# Altium schematic sheet callisto_schematics_digital.SchDoc: Callisto Module Digital
size A3; ApprovedBy: Tomash Ghz; CheckedBy: Tomash Ghz; Author: Tomash Ghz; CompanyName: GHz Labs; DrawnBy: Tomash Ghz; Engineer: Tomash Ghz; Organization: GHz Labs; Address1: Tomash Ghz; Address2: Berlin 2019; Revision: 1.0; SheetNumber: 1; SheetTotal: 2; DocumentName: Callisto Module Digital; ProjectName: Callisto Module
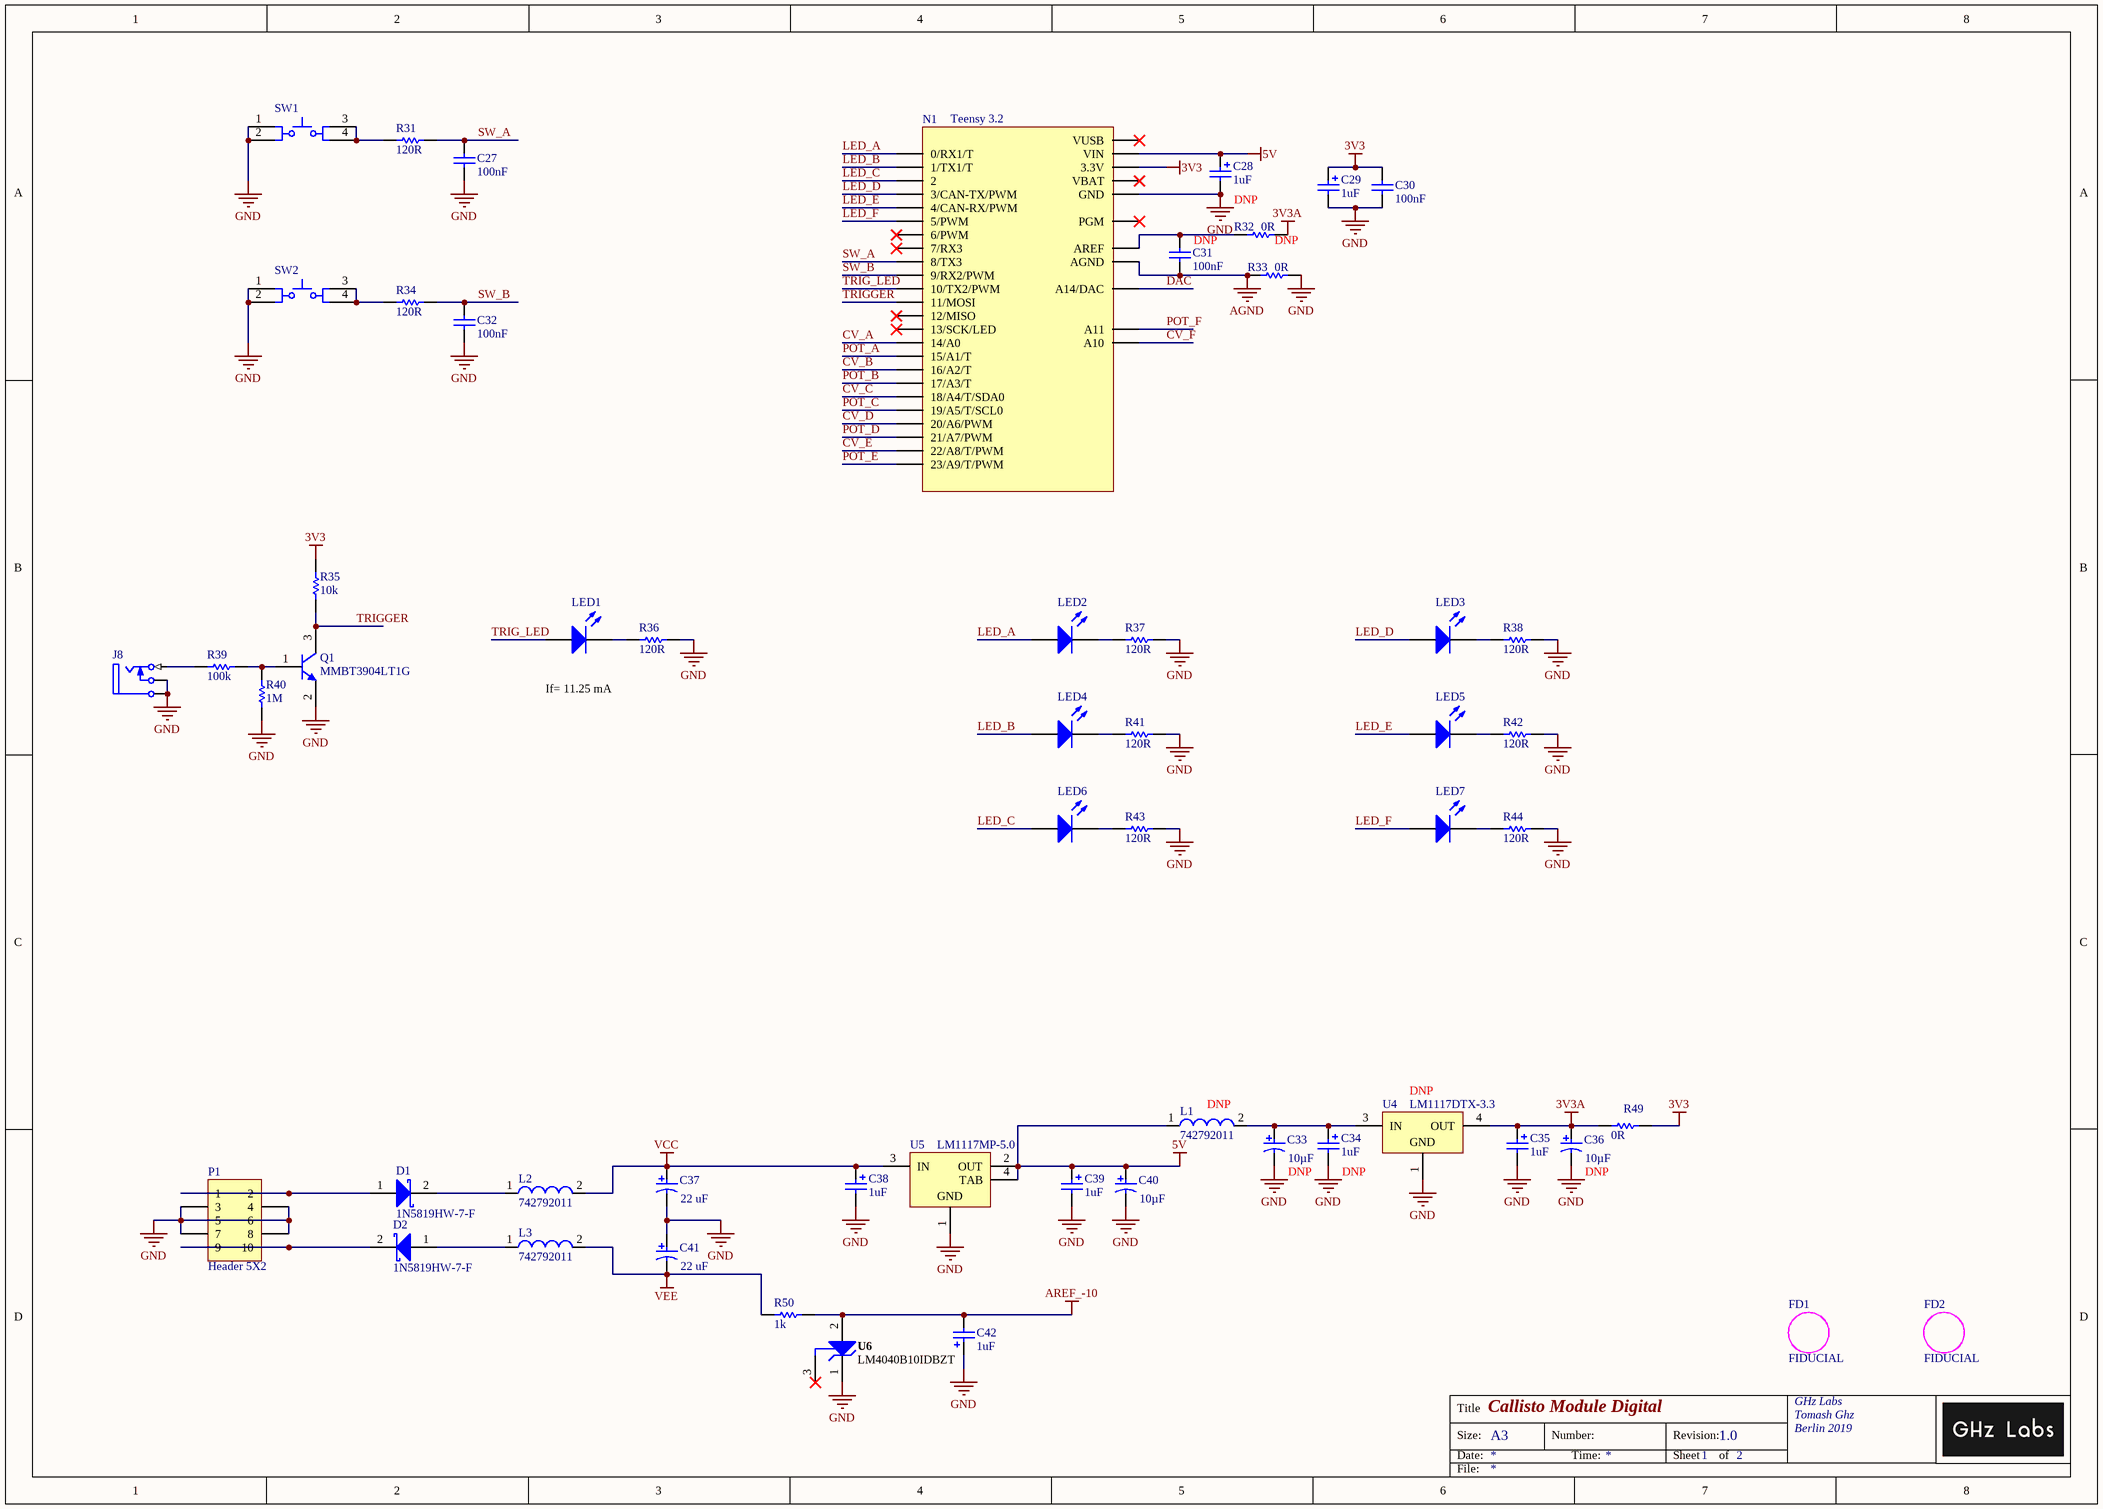
[diagram p0: callisto_schematics_digital.SchDoc]

## Parts
C27  100nF  [CAPA_0805]
C28  1uF  [CAPA_0805 Pol]
C29  1uF  [CAPA_0805 Pol]
C30  100nF  [CAPA_0805]
C31  100nF  [CAPA_0805]
C32  100nF  [CAPA_0805]
C33  Capacitance: 10µF  [PNSC-FK-V-B_V]  (hidden comment: EEE-FK1V100UR)
C34  1uF  [CAPA_0805 Pol]
C35  1uF  [CAPA_0805 Pol]
C36  Capacitance: 10µF  [PNSC-FK-V-B_V]  (hidden comment: EEE-FK1V100UR)
C37  Rated Capacitance: 22 uF  [NIC-CAPA2-5X5.8_V]  (hidden comment: 22uF Electrolytic Capacitor)
C38  1uF  [CAPA_0805 Pol]
C39  1uF  [CAPA_0805 Pol]
C40  Capacitance: 10µF  [PNSC-FK-V-B_V]  (hidden comment: 10uF Electrolytic Capacitor)
C41  Rated Capacitance: 22 uF  [NIC-CAPA2-5X5.8_V]  (hidden comment: 22uF Electrolytic Capacitor)
C42  1uF  [CAPA_0805 Pol]
D1  1N5819HW-7-F  [DIOD-SOD-123-2_V]
D2  1N5819HW-7-F  [DIOD-SOD-123-2_V]
FD1  FIDUCIAL  [FIDUCIAL]  (no BOM)
FD2  FIDUCIAL  [FIDUCIAL]  (no BOM)
J8  Phonejack2 TN  [Thonkiconn]  (value not drawn)
L1  742792011  [SMD-0805]
L2  742792011  [SMD-0805]
L3  742792011  [SMD-0805]
LED1  WP424YDT  [Type 3mm]  (value not drawn)
LED2  WP424YDT  [Type 3mm]  (value not drawn)
LED3  WP424YDT  [Type 3mm]  (value not drawn)
LED4  WP424YDT  [Type 3mm]  (value not drawn)
LED5  WP424YDT  [Type 3mm]  (value not drawn)
LED6  WP424YDT  [Type 3mm]  (value not drawn)
LED7  WP424YDT  [Type 3mm]  (value not drawn)
N1  Teensy 3.2  [TEENSY_3.0-3.2&LC_ALL_PINS]
P1  Header 5X2  [HDR2X5]
Q1  MMBT3904LT1G  [ONSC-SOT-23-3-318-08_V]
R31  120R  [RES_0805]
R32  0R  [RES_0805]
R33  0R  [RES_0805]
R34  120R  [RES_0805]
R35  10k  [RES_0805]
R36  120R  [RES_0805]
R37  120R  [RES_0805]
R38  120R  [RES_0805]
R39  100k  [RES_0805]
R40  1M  [RES_0805]
R41  120R  [RES_0805]
R42  120R  [RES_0805]
R43  120R  [RES_0805]
R44  120R  [RES_0805]
R49  0R  [RES_0805]
R50  1k  [RES_0805]
SW1  Tact Switch  [ESWI-TL1105SPF_V]  (value not drawn)
SW2  Tact Switch  [ESWI-TL1105SPF_V]  (value not drawn)
U4  LM1117DTX-3.3  [TD03B_M]
U5  LM1117MP-5.0  [MP04A_M]
U6  LM4040B10IDBZT  [DBZ0003A_M]

## Nets
3V3: C29.1 C30.1 N1.3.3V_3.3V1(3.3V) R35.1 R49.2
3V3A: C35.1 C36.1 R32.2 R49.1 U4.4(OUT)
5V: C28.1 C39.1 C40.1 L1.1 N1.VIN U5.2(OUT) U5.4(TAB)
AGND: C31.2 N1.AGND R33.1
AREF_-10: C42.2 R50.1 U6.2(ANODE)
GND: C27.2 C28.2 C29.2 C30.2 C32.2 C33.2 C34.2 C35.2 C36.2 C37.2 C38.2 C39.2 C40.2 C41.1 C42.1 J8.2(TN) J8.5(S) N1.GND_GND1(GND) P1.3 P1.4 P1.5 P1.6 P1.7 P1.8 Q1.2(E) R33.2 R36.1 R37.1 R38.1 R40.2 R41.1 R42.1 R43.1 R44.1 SW1.1 SW1.2 SW2.1 SW2.2 U4.1(GND) U5.1(GND) U6.1(CATHODE)
VCC: C37.1 C38.1 L2.2 U5.3(IN)
VEE: C41.2 L3.2 R50.2
CV_A: N1.14/A0
CV_B: N1.16/A2(16/A2/T)
CV_C: N1.18/A4(18/A4/T/SDA0)
CV_D: N1.20/A6(20/A6/PWM)
CV_E: N1.22/A8(22/A8/T/PWM)
CV_F: N1.A10
DAC: N1.RESET/DAC(A14/DAC)
LED_A: LED2.2(A) N1.0(0/RX1/T)
LED_B: LED4.2(A) N1.1(1/TX1/T)
LED_C: LED6.2(A) N1.2
LED_D: LED3.2(A) N1.3(3/CAN-TX/PWM)
LED_E: LED5.2(A) N1.4(4/CAN-RX/PWM)
LED_F: LED7.2(A) N1.5(5/PWM)
POT_A: N1.15/A1(15/A1/T)
POT_B: N1.17/A3(17/A3/T)
POT_C: N1.19/A5(19/A5/T/SCL0)
POT_D: N1.21/A7(21/A7/PWM)
POT_E: N1.23/A9(23/A9/T/PWM)
POT_F: N1.A11
SW_A: C27.1 N1.8(8/TX3) R31.1
SW_B: C32.1 N1.9(9/RX2/PWM) R34.1
TRIG_LED: LED1.2(A) N1.10(10/TX2/PWM)
TRIGGER: N1.11(11/MOSI) Q1.3(C) R35.2
NetC31_1: C31.1 N1.AREF R32.1
NetC33_1: C33.1 C34.1 L1.2 U4.3(IN)
NetD1_1: D1.1(A) P1.1 P1.2
NetD1_2: D1.2(K) L2.1
NetD2_1: D2.1(A) L3.1
NetD2_2: D2.2(K) P1.9 P1.10
NetJ8_1: J8.1(T) R39.2
NetLED1_1: LED1.1(K) R36.2
NetLED2_1: LED2.1(K) R37.2
NetLED3_1: LED3.1(K) R38.2
NetLED4_1: LED4.1(K) R41.2
NetLED5_1: LED5.1(K) R42.2
NetLED6_1: LED6.1(K) R43.2
NetLED7_1: LED7.1(K) R44.2
NetQ1_1: Q1.1(B) R39.1 R40.1
NetR31_2: R31.2 SW1.3 SW1.4
NetR34_2: R34.2 SW2.3 SW2.4

Not connected (* = marked no-connect by the designer): N1 6(6/PWM)* 7(7/RX3)* 12(12/MISO)* 13(13/SCK/LED)* PGM* VBAT* VUSB*; U6 3(NC)*

## Notes on the sheet
- (near C31) DNP
- DNP
- (near R32) DNP
- If= 11.25 mA
- (near L1) DNP
- (near U4) DNP
- (near C36) DNP
- Title
- Size:
- Date:
- A3
- Number:
- Time:
- Revision:
- Sheet
- of
- File:

## Library data of the parts
C27 C30-C32 = Cap: Capacitor; PartNumber: C0805C104K4RAC; Manufacturer: KEMET; Published: 8-Jun-2000; LatestRevisionDate: 17-Jul-2002; LatestRevisionNote: Re-released for DXP Platform.; PackageReference: RAD-0.3; Publisher: Altium Limited; PackageDescription: Radial Cap, Thru-Hole; 2 Leads; 0.3 in Pin Spacing; Value: 100nF
C28 C29 C34 C35 C38 C39 C42 = Cap Pol2: Polarized Capacitor; PartNumber: GRM21BR61C105KA01L; Manufacturer: Murata Electronics; Value: 1uF; Mouser: http://www.mouser.de/ProductDetail/Murata-Electronics/GRM21BR61C105KA01L/?qs=sGAEpiMZZMs0AnBnWHyRQHqtMhGnfkOVy3Os4ZS1iuU%3d
C33 C36 = CMP-2000-06211-1: Aluminum Electrolytic Capacitor, 10 uF, +/- 20%, 35 V, 2-Pin SMD (Size Code B), -55 to 105 degC, RoHS, Tape and Reel; Manufacturer: Panasonic; Impedance: 1.35O; Rated Voltage: 35V; Lifetime@Temperature: 2000Hrs@105°C; Ripple Current: 90mA; Type: Can; Manufacturer URL: http://www.panasonic.com/; Package Reference: FK-V-B; Operating Temp Range: -55to+105°C; Series: FK; Datasheet URL: http://industrial.panasonic.com/cdbs/www-data/pdf/RDE0000/ABA0000C1181.pdf; Mounting Technology: SurfaceMount; Package URL: http://industrial.panasonic.com/cdbs/www-data/pdf/RDE0000/DME0000COL48.pdf; Package Description: 2-Pin Electrolytic Aluminum Capacitor, Body 4.3 x 4.3 mm; Datasheet Version: 03/2016; Case Size/Dimension: Ø4x5.8mm; Operating Temp-Max: 105°C
C37 C41 = CMP-0687-00027-1: Aluminum Electrolytic Capacitor, UD Series, Low Impedance, 22 uF, 16 V, + / - 20%, -55 to 105 degC, Chip Type, 5 x 5.8 mm D x L, Pb-Free, Reel; PartNumber: EEE-FK1V220R; Manufacturer: Panasonic; Tolerance Rated Capacitance: -20 to 20%; Endurance Time: 2000 h; Impedance: 0.76 Ohm; Rated Voltage: 16 V; Rated Ripple Current (at 100kHz): 150 mA; Packing: Dia382mm Reel; RoHS: TRUE; ComponentLink1URL: http://www.nichicon.co.jp/; PackageReference: CAPAE-D5H5.8; ComponentLink2URL: http://products.nichicon.co.jp/en/pdf/XJA043/e-ud.pdf; ComponentLink3URL: http://products.nichicon.co.jp/en/pdf/XJA043/e-ud.pdf; PackageDescription: 2-Pin Surface Mount Device, Diameter 5 mm, Height 5.8 mm, Pitch 4.4 mm; DatasheetVersion: 08/2012; Mounting Technology: Surface Mount; ComponentLink1Description: Manufacturer URL; Diameter: 5 mm; ComponentLink2Description: Datasheet; Length: 5.8 mm; ComponentLink3Description: Package Specification; Value: 22uF
C40 = CMP-2000-06211-1: Aluminum Electrolytic Capacitor, 10 uF, +/- 20%, 35 V, 2-Pin SMD (Size Code B), -55 to 105 degC, RoHS, Tape and Reel; Manufacturer: Panasonic; PartNumber: EEE-FK1E100R; Impedance: 1.35O; Rated Voltage: 35V; Lifetime@Temperature: 2000Hrs@105°C; Ripple Current: 90mA; Type: Can; Manufacturer URL: http://www.panasonic.com/; Package Reference: FK-V-B; Operating Temp Range: -55to+105°C; Series: FK; Datasheet URL: http://industrial.panasonic.com/cdbs/www-data/pdf/RDE0000/ABA0000C1181.pdf; Mounting Technology: SurfaceMount; Package URL: http://industrial.panasonic.com/cdbs/www-data/pdf/RDE0000/DME0000COL48.pdf; Package Description: 2-Pin Electrolytic Aluminum Capacitor, Body 4.3 x 4.3 mm; Datasheet Version: 03/2016; Case Size/Dimension: Ø4x5.8mm; Operating Temp-Max: 105°C; Value: 10uF
D1 D2 = CMP-0303-00003-1: 1.0 A Surface Mount Schottky Barrier Rectifier, 40 V, -65 to 125 degC, 2-Pin SOD-123 Package, RoHS, Tape and Reel; Manufacturer: Diodes Inc; @ VR (V): 40; @ Terminal Temperature TT (degC): 90; Maximum Average Rectified Current IO (A): 1; Total Capacitance CT (pF): 50; Peak Forward Surge Current IFSM (A): 25; Forward Voltage Drop VF (V): 0.45; VR (RMS) (V): 28; RoHS: TRUE; PartNumber: 1N5819HW-7-F; ComponentLink2URL: http://www.diodes.com/datasheets/ds30217.pdf; PackageDescription: 2-Pin SOD-123, Body 2.7 x 1.55 mm, Pitch 3.7 mm; @ IF (A): 1; Operating and Storage Temperature Range: -65 to 125 degC; ComponentLink1Description: Manufacturer URL; ComponentLink2Description: Datasheet; ComponentLink1URL: http://www.diodes.com/; Mounting Technology: Surface Mount; DatasheetVersion: Rev. 15-2; PackageReference: SOD-123-2; Maximum Reverse Current IR (uA): 50; Peak Repetitive Reverse Voltage VRRM (V): 40; Packing: Tape and Reel
FD1 FD2 = FIDUCIAL_ROUND: Fiducial - Round 1.5 mm Top-Bottom; Manufacturer: No Vendor; PartNumber: FIDUCIAL
J8 = Phonejack2 TN: Jack Socket; Part: ACJM-MV35-2S; Manufacturer: Thonk; PartNumber: PJ398SM; Mouser: http://www.mouser.de/ProductDetail/Amphenol/ACJM-MV35-2S/?qs=%2fha2pyFaduh8uNgKuHZ7oEtHXwcSE0WAH4R1pjDPuhAHZsUXTeJRNg%3d%3d; Datasheet: http://www.amphenolaudio.com/wp-content/uploads/2015/07/55010544-001-rev-2.pdf; Thonk: https://www.thonk.co.uk/shop/3-5mm-jacks/
L1 = CMP-0220-00043-1: SMD EMI Suppression Ferrite Bead WE-CBF, Z = 10 Ohm; Impedance: 10 Ohm; PackageDescription: Chip Inductor, 2-Leads, Body 2.0 x 1.2 mm; PackageReference: SMD-0805; ComponentLink1URL: http://www.we-online.com; PackageVersion: 2005; ComponentLink2Description: Datasheet; ComponentLink2URL: http://www.we-online.de/katalog/media/pdf/742792011.pdf; ComponentLink1Description: Manufacturer Link; DatasheetVersion: Dec-2005
L2 L3 = CMP-0220-00043-1: SMD EMI Suppression Ferrite Bead WE-CBF, Z = 10 Ohm; Manufacturer: Wurth Elektronik; Impedance: 10 Ohm; PackageDescription: Chip Inductor, 2-Leads, Body 2.0 x 1.2 mm; PackageReference: SMD-0805; ComponentLink1URL: http://www.we-online.com; PackageVersion: 2005; ComponentLink2Description: Datasheet; ComponentLink2URL: http://www.we-online.de/katalog/media/pdf/742792011.pdf; ComponentLink1Description: Manufacturer Link; DatasheetVersion: Dec-2005; PartNumber: 742792011
LED1-LED7 = CMP-1488-00001-1: THT LED round mono-color color lens, WL-TMRC, Bright Green; Manufacturer: Kingbright; ComponentLink1URL: http://www.we-online.com; Emitting color: Bright Green; ComponentLink2URL: http://katalog.we-online.de/pbs/datasheet/7448042001.pdfhttp://katalog.we-online.de/pbs/datasheet/7448042001.pdfhttp://katalog.we-online.de/pbs/datasheet/7448042001.pdfhttp://katalog.we-online.de/pbs/datasheet/151031VS04000.pdf; PartNumber: WP424YDT; PackageReference: Type 3mm; ComponentLink2Description: Datasheet; ComponentLink1Description: Manufacturer URL
N1 = TEENSY_3.1-3.2_ALL_PINS: Teensy 3.2 MCU; pin to pad: 3.3V 3.3V1>3.3V GND GND1>GND; PartNumber: DEV-13736; Manufacturer: SparkFun; Mouser: http://www.mouser.de/ProductDetail/SparkFun/DEV-13736/?qs=sGAEpiMZZMuWWq7rhECaKVjnUlbUDjFgBj37EAXueZA%3d
P1 = Header 5X2: Header, 5-Pin, Dual row; PartNumber: 67996-410HLF; Manufacturer: FCI Amphenol; LatestRevisionDate: 17-Jul-2002; LatestRevisionNote: Re-released for DXP Platform.; Publisher: Altium Limited
Q1 = CMP-1048-00631-1: General Purpose Transistor, NPN Silicon, 3-Pin SOT-23, Pb-Free, Tape and Reel; Manufacturer: On Semiconductor; IC Continuous (A): 0.2; fT Min (MHz): 300; ComponentLink2Description: Datasheet; Polarity: NPN; PackageDescription: 3-Pin Small Outline Transistor, Body 2.92 x 1.3 mm, Pitch 0.95 mm; ComponentLink2URL: http://www.onsemi.cn/pub_link/Collateral/MMBT3904LT1-D.PDF; DatasheetVersion: Rev. 12; Mounting Technology: Surface Mount; PartNumber: MMBT3904LT1G; ComponentLink1URL: http://www.onsemi.com/; ComponentLink3Description: Package Specification; ComponentLink1Description: Manufacturer URL; PackageVersion: Rev. AP, 11/2009; PackageReference: SOT-23-3-318-08; Packing: Tape and Reel; ComponentLink3URL: http://www.onsemi.cn/pub_link/Collateral/318-08.PDF; RoHS: TRUE
R31 R34 R36-R38 R41-R44 = Resistor: 120R 0805; PartNumber: CRCW0805120RJNEA; Manufacturer: Vishay; Value: 120R; Mouser: http://www.mouser.de/ProductDetail/Susumu/RR1220P-105-D/?qs=sGAEpiMZZMu61qfTUdNhG%2fDhcyQpRg8MxiYDTLm9lx4%3d
R32 R33 R49 = Resistor: 0R 0805; PartNumber: CRCW08050000Z0EA; Manufacturer: Vishay; Value: 0R; Mouser: http://www.mouser.de/ProductDetail/Susumu/RR1220P-104-D/?qs=sGAEpiMZZMu61qfTUdNhG%2fDhcyQpRg8MUHr%252b%2fl2FgBo%3d
R35 = Resistor: 10k 0805; PartNumber: RR1220P-103-D; Manufacturer: Susumu; Value: 10k; Mouser: http://www.mouser.de/ProductDetail/Susumu/RR1220P-105-D/?qs=sGAEpiMZZMu61qfTUdNhG%2fDhcyQpRg8MxiYDTLm9lx4%3d
R39 = Resistor: 100k 0805; PartNumber: RR1220P-104-D; Manufacturer: Susumu; Value: 100k; Mouser: http://www.mouser.de/ProductDetail/Susumu/RR1220P-105-D/?qs=sGAEpiMZZMu61qfTUdNhG%2fDhcyQpRg8MxiYDTLm9lx4%3d
R40 = Resistor: 1M 0805; PartNumber: RR1220P-105-D; Manufacturer: Susumu; Value: 1M; Mouser: http://www.mouser.de/ProductDetail/Susumu/RR1220P-105-D/?qs=sGAEpiMZZMu61qfTUdNhG%2fDhcyQpRg8MxiYDTLm9lx4%3d
R50 = Resistor: 1k 0805; PartNumber: RR1220P-102-D; Manufacturer: Susumu; Value: 1k; Mouser: http://www.mouser.de/ProductDetail/Susumu/RR1220P-103-D/?qs=sGAEpiMZZMu61qfTUdNhG%2fDhcyQpRg8MdkVTtHR2gV4%3d
SW1 SW2 = CMP-2000-07248-1: Tact Switch, SPST-NO, 50 mA, 12 VDC, -20 to 70 degC, 4-Pin THD, RoHS, Bulk; Manufacturer: E-Switch; PartNumber: TL1105SPF100Q; Actuation Force: 1.6N; Actuator Style: RoundButton; Package URL: http://spec_sheets.e-switch.com/specs/P010201.pdf; Contact Material: Silver; Size: 6x6mm; Manufacturer URL: http://www.e-switch.ch/en/; Datasheet Version: 12/2013; Package Description: 4-Pin Through Hole Device, Body 6 x 6 mm; Datasheet URL: https://www.e-switch.com/system/asset/product_line/data_sheet/140/TL1105.pdf; Termination Style: RightAngle; Package Reference: TL1105SPF; Mounting Technology: ThroughHole
U4 = CMP-0062-00706-2: 800mA Low-Dropout Linear Regulator, 3-pin TO-252; Manufacturer: National Semiconductor; PackageTopMarking: NSUZXYTT*LM1117*DT-3.3; PowerWise: N; CompType: LDO IC; ComponentLink3URL: http://www.national.com/packaging/folders/td03b.html; ComponentLink2URL: http://www.national.com/pf/LM/LM1117.html; ComponentLink2Description: LM1117 Web Page; PinCount: 3; ComponentLink1URL: http://www.national.com/ds/LM/LM1117.pdf; ComponentLink3Description: TD03B Package Page; Code_JEDEC: TO-252-AA; ComponentLink1Description: LM1117 Datasheet; PackageVersion: revD, Feb-2009; RevisionNote: Component URLs added; RoHS: N; DatasheetVersion: Apr-2006; PackageReference: TD03B; PackageDescription: TO252, Molded, Jedec, 6.8 x 6.10 x 2.30mm Body, 3 Lead, 2.28mm Pitch, Surface Mount
U5 = CMP-0062-01640-3: 800mA Low-Dropout Linear Regulator, 4-pin SOT-223; Manufacturer: National Semiconductor; CompType: LDO IC; PackageTopMarking: XYTT*N06A; High-Reliability: Y; PowerWise: N; Code_IPC: SOT223-4; PackageVersion: revB, Apr-2003; RoHS: N; Code_JEDEC: TO-261-AA; PinCount: 4; ComponentLink1URL: http://www.national.com/; ComponentLink4URL: http://www.national.com/packaging/folders/mp04a.html; RevisionNote: SCH symbol layout adjusted; PackageDescription: Molded SOT-223, 6.50 x 3.56 x 1.6mm Body, 4 Lead, 2.3mm Pitch; DatasheetVersion: Apr-2006; ComponentLink3URL: http://www.national.com/pf/LM/LM1117.html; ComponentLink2URL: http://www.national.com/ds/LM/LM1117.pdf; PartNumber: LM1117MP-5.0; ComponentLink2Description: LM1117 Datasheet; ComponentLink3Description: LM1117 Web Page; ComponentLink4Description: MP04A Package Page; PackageReference: MP04A; ComponentLink1Description: Manufacturer URL
U6 = CMP-0366-01043-2: Precision Micropower Shunt Voltage Reference, 0.2% Accuracy, 10 V, 15 ppm / degC, 15 mA, -40 to 85 degC, 3-pin SOT-23 (DBZ), Green (RoHS & no Sb/Br); Manufacturer: Texas Instruments; Temp Coeff(Max)(ppm/ degree C): 100; Rating: Catalog; VO(V): 10; Iout/Iz(Max)(mA): 15; Initial Accuracy @ 25/deg C(%): 0.2; ComponentLink2Description: Datasheet; ComponentLink1URL: http://www.ti.com/; ComponentLink4URL: Samples URL:http://www.ti.com/product/lm4040b10; ComponentLink3Description: Package Specification; PartNumber: LM4040B10IDBZT; DatasheetVersion: SLOS456K; Mounting Technology: Surface Mount; Eco-Plan: Green (RoHS & no Sb/Br); Code_JEDEC: TO-236; SubFamily: Shunt Voltage Reference; PackageDescription: 3-Pin Plastic Small Outline, Body 2.92 x 1.3 mm, Pitch 0.95 mm; ComponentLink2URL: http://www.ti.com/general/docs/lit/getliterature.tsp?genericPartNumber=LM4040B10&fileType=pdf; PackageVersion: 4203227/B; ComponentLink1Description: Manufacturer URL; ComponentLink3URL: http://www.ti.com/litv/pdf/mpds108a; Temp Coeff(Typ)(ppm/ degree C): 15; ComponentLink4Description: URL Link1; Min Iz for Regulation(uA): 100; PackageReference: DBZ0003A